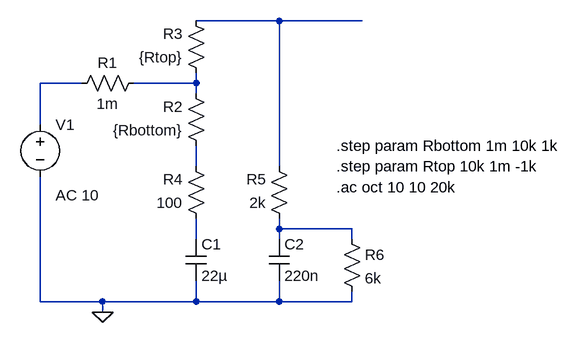
[diagram p0: schematic loudness_control.asc]
loudness_control.asc, the LTspice schematic file:
Version 4
SHEET 1 896 680
WIRE 432 -48 304 -48
WIRE 560 -48 432 -48
WIRE 128 48 64 48
WIRE 304 48 304 32
WIRE 304 48 208 48
WIRE 304 64 304 48
WIRE 64 112 64 48
WIRE 304 176 304 144
WIRE 432 176 432 -48
WIRE 432 272 432 256
WIRE 544 272 432 272
WIRE 304 288 304 256
WIRE 432 288 432 272
WIRE 544 288 544 272
WIRE 64 384 64 192
WIRE 160 384 64 384
WIRE 304 384 304 352
WIRE 304 384 160 384
WIRE 432 384 432 352
WIRE 432 384 304 384
WIRE 544 384 544 368
WIRE 544 384 432 384
WIRE 160 400 160 384
FLAG 160 400 0
SYMBOL voltage 64 96 R0
WINDOW 123 24 124 Left 2
WINDOW 39 0 0 Left 0
SYMATTR InstName V1
SYMATTR Value ""
SYMATTR Value2 AC 10
SYMBOL res 224 32 R90
WINDOW 0 0 56 VBottom 2
WINDOW 3 32 56 VTop 2
SYMATTR InstName R1
SYMATTR Value 1m
SYMBOL res 320 160 R180
WINDOW 0 36 76 Left 2
WINDOW 3 36 40 Left 2
SYMATTR InstName R2
SYMATTR Value {Rbottom}
SYMBOL res 320 48 R180
WINDOW 0 36 76 Left 2
WINDOW 3 36 40 Left 2
SYMATTR InstName R3
SYMATTR Value {Rtop}
SYMBOL res 320 272 R180
WINDOW 0 36 76 Left 2
WINDOW 3 36 40 Left 2
SYMATTR InstName R4
SYMATTR Value 100
SYMBOL res 448 272 R180
WINDOW 0 36 76 Left 2
WINDOW 3 36 40 Left 2
SYMATTR InstName R5
SYMATTR Value 2k
SYMBOL cap 288 288 R0
SYMATTR InstName C1
SYMATTR Value 22µ
SYMBOL cap 416 288 R0
SYMATTR InstName C2
SYMATTR Value 220n
SYMBOL res 528 272 R0
SYMATTR InstName R6
SYMATTR Value 6k
TEXT 520 144 Left 2 !.step param Rbottom 1m 10k 1k
TEXT 520 176 Left 2 !.step param Rtop 10k 1m -1k
TEXT 520 208 Left 2 !.ac oct 10 10 20k

The netlist it stands for:
* loudness_control.asc
V1 N002 0 AC 10
R1 N003 N002 1m
R2 N004 N003 {Rbottom}
R3 N003 N001 {Rtop}
R4 N006 N004 100
R5 N005 N001 2k
C1 N006 0 22µ
C2 N005 0 220n
R6 N005 0 6k
.step param Rbottom 1m 10k 1k
.step param Rtop 10k 1m -1k
.ac oct 10 10 20k
.backanno
.end